# EAGLE design BUZZI-33 (EAGLE 4.15)
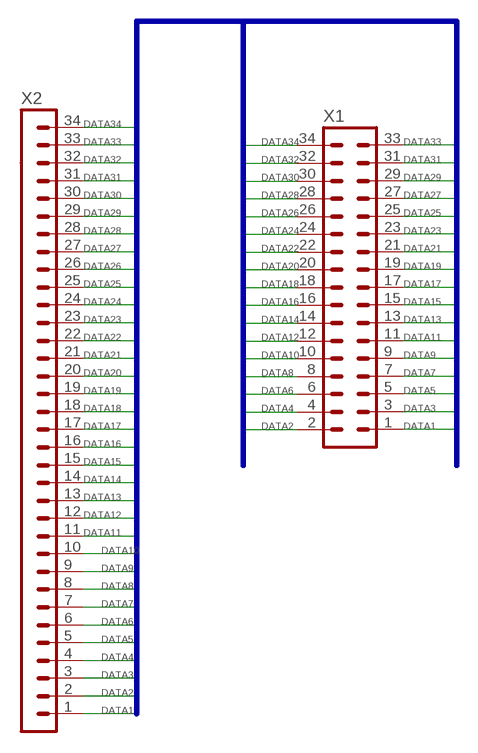
[diagram p0: schematic, sheet 1]

## Parts
X1  ML34  [ML34]
X2  MA34  [MA34-1]

## Nets
DATA1: X1.1 X2.1
DATA2: X1.2 X2.2
DATA3: X1.3 X2.3
DATA4: X1.4 X2.4
DATA5: X1.5 X2.5
DATA6: X1.6 X2.6
DATA7: X1.7 X2.7
DATA8: X1.8 X2.8
DATA9: X1.9 X2.9
DATA10: X1.10 X2.10
DATA11: X1.11 X2.11
DATA12: X1.12 X2.12
DATA13: X1.13 X2.13
DATA14: X1.14 X2.14
DATA15: X1.15 X2.15
DATA16: X1.16 X2.16
DATA17: X1.17 X2.17
DATA18: X1.18 X2.18
DATA19: X1.19 X2.19
DATA20: X1.20 X2.20
DATA21: X1.21 X2.21
DATA22: X1.22 X2.22
DATA23: X1.23 X2.23
DATA24: X1.24 X2.24
DATA25: X1.25 X2.25
DATA26: X1.26 X2.26
DATA27: X1.27 X2.27
DATA28: X1.28 X2.28
DATA29: X1.29 X2.29
DATA30: X1.30 X2.30
DATA31: X1.31 X2.31
DATA32: X1.32 X2.32
DATA33: X1.33 X2.33
DATA34: X1.34 X2.34

## Buses
DATA[1..34]

## Library data of the parts
X1 = con-harting-ml:ML34: HARTING
X2 = turbod3:MA34

## Net classes
0 default: width 0.5 mm

## Board
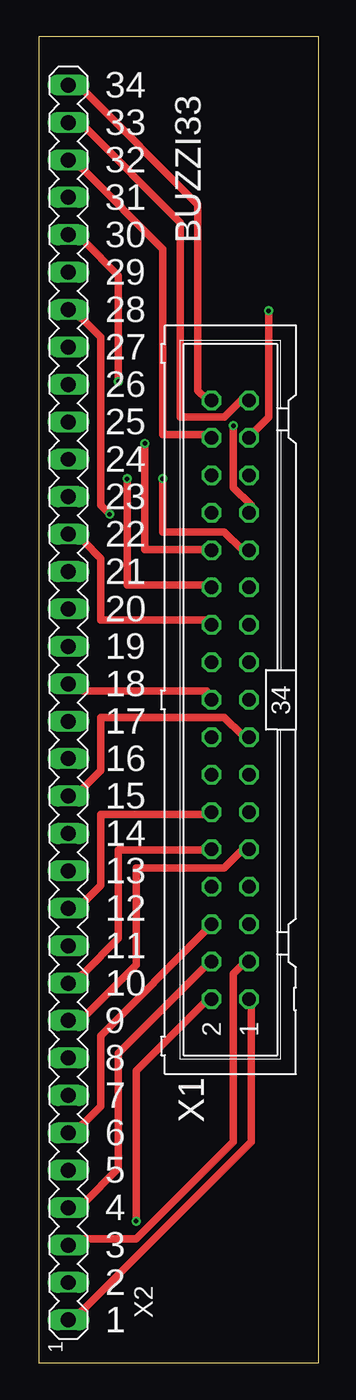
[diagram p1: board, top side]
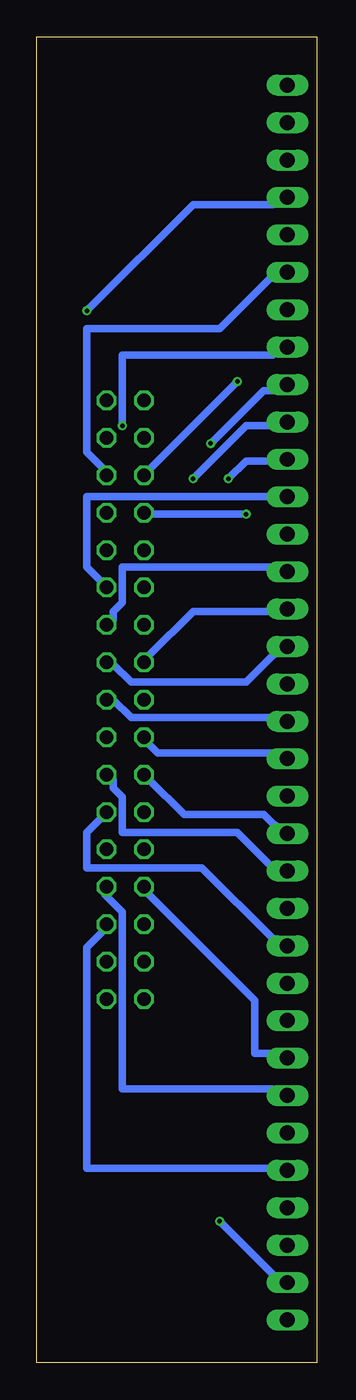
[diagram p2: board, bottom side, seen from below]

Size 19 x 90 mm. Coordinates in mm from the lower left corner, seen from the top.
Outline: 0,0 19,0 19,90 0,90 0,0
Copper layers (1*16): Top 0.035mm / dielectric 1.5mm / Bottom 0.035mm
Design rules "PCB-POOL": minimum track width 6mil, minimum drill 12mil, track to track 6mil, track to pad 6mil, pad to pad 6mil, via to via 6mil, smd to smd 6mil, copper to edge 20mil, drill to drill 8mil, minimum pad ring 8mil, minimum via ring 6mil, stop-mask expansion 3mil, vias tented up to drill 0mil, thermal gap 8mil

### Footprints (pad centres in the part's own frame; a part is rotated, then mirrored left to right if it is on the bottom)
ML34 = drill 0.914 octagon: 1 -20.32,-1.27; 2 -20.32,1.27; 3 -17.78,-1.27; 4 -17.78,1.27; 5 -15.24,-1.27; 6 -15.24,1.27; 7 -12.7,-1.27; 8 -12.7,1.27; 9 -10.16,-1.27; 10 -10.16,1.27; 11 -7.62,-1.27; 12 -7.62,1.27; 13 -5.08,-1.27; 14 -5.08,1.27; 15 -2.54,-1.27; 16 -2.54,1.27; 17 0,-1.27; 18 0,1.27; 19 2.54,-1.27; 20 2.54,1.27; 21 5.08,-1.27; 22 5.08,1.27; 23 7.62,-1.27; 24 7.62,1.27; 25 10.16,-1.27; 26 10.16,1.27; 27 12.7,-1.27; 28 12.7,1.27; 29 15.24,-1.27; 30 15.24,1.27; 31 17.78,-1.27; 32 17.78,1.27; 33 20.32,-1.27; 34 20.32,1.27
MA34-1 = drill 1.016 long: 1 -38.1,0; 2 -35.56,0; 3 -33.02,0; 4 -30.48,0; 5 -27.94,0; 6 -25.4,0; 7 -22.86,0; 8 -20.32,0; 9 -17.78,0; 10 -15.24,0; 11 -12.7,0; 12 -10.16,0; 13 -7.62,0; 14 -5.08,0; 15 -2.54,0; 16 0,0; 17 2.54,0; 18 5.08,0; 19 7.62,0; 20 10.16,0; 21 12.7,0; 22 15.24,0; 23 17.78,0; 24 20.32,0; 25 22.86,0; 26 25.4,0; 27 27.94,0; 28 30.48,0; 29 33.02,0; 30 35.56,0; 31 38.1,0; 32 40.64,0; 33 43.18,0; 34 45.72,0

### Placement (x,y rotation side)
X1  13,45 90 top
X2  2,41 90 top

### Tracks (layer width: path | path; a pad name or v marks a point on that pad's centre or on a via)
DATA1
  Top 0.5: X1.1 14.4,24.6 14.4,15 3,3.6 X2.1
DATA2  (via drill 0.3)
  Top 0.5: v6.6,9.6 6.6,19.8 11.4,24.6 X1.2
  Bottom 0.5: v6.6,9.6 3,6 X2.2
DATA3
  Top 0.5: X1.3 13.8,27 13.2,26.4 13.2,15 6.6,8.4 3,8.4 X2.3
DATA4
  Top 0.5: X1.4 11.4,27 5.4,21 5.4,13.2 3,10.8 X2.4
DATA5
  Bottom 0.5: X1.5 14.4,29.4 15.6,28.2 15.6,13.2 3,13.2 X2.5
DATA6
  Top 0.5: X1.6 11.4,29.4 4.2,22.2 4.2,17.4 3,16.2 X2.6
DATA7
  Bottom 0.5: X1.7 14.4,31.8 13.2,30.6 13.2,18.6 3,18.6 X2.7
DATA8
  Bottom 0.5: X1.8 11.4,31.8 4.2,24.6 4.2,21 3,21 X2.8
DATA9
  Top 0.5: X1.9 13.8,34.8 12.6,33.6 6.6,33.6 6.6,27 3,23.4 X2.9
DATA10
  Top 0.5: X1.10 11.4,34.8 5.4,34.8 5.4,28.8 3,26.4 X2.10
DATA11
  Bottom 0.5: X1.11 14.4,37.2 15.6,36 15.6,33.6 7.8,33.6 3,28.8 X2.11
DATA12
  Top 0.5: X1.12 11.4,37.2 4.2,37.2 4.2,32.4 3,31.2 X2.12
DATA13
  Bottom 0.5: X1.13 13.8,39.6 13.8,39 13.2,38.4 13.2,36 5.4,36 3,33.6 X2.13
DATA14
  Bottom 0.5: X1.14 11.4,39.6 9,37.2 3.6,37.2 3,36.6 X2.14
DATA15
  Top 0.5: X1.15 13.8,42.6 12.6,43.8 4.2,43.8 4.2,40.2 3,39 X2.15
DATA16
  Bottom 0.5: X1.16 11.4,42 10.8,41.4 3,41.4 X2.16
DATA17
  Bottom 0.5: X1.17 13.8,45 12.6,43.8 3,43.8 X2.17
DATA18
  Top 0.5: X1.18 11.4,45.6 3,45.6 X2.18
DATA19
  Bottom 0.5: X1.19 13.8,47.4 12.6,46.2 4.8,46.2 3,48 X2.19
DATA20
  Bottom 0.5: X1.20 11.4,48 8.4,51 3,51 X2.20
DATA21
  Bottom 0.5: X1.21 13.8,50.4 13.8,51 13.2,51.6 13.2,54 3,54 X2.21
DATA22
  Top 0.5: X1.22 11.4,50.4 4.2,50.4 4.2,54.6 3,55.8 X2.22
DATA23
  Bottom 0.5: X1.23 14.4,52.8 15.6,54 15.6,58.8 3,58.8 X2.23
DATA24  (via drill 0.3)
  Top 0.5: v6,60 6,52.8 11.4,52.8 X1.24
  Bottom 0.5: v6,60 4.8,61.2 3,61.2 X2.24
DATA25  (via drill 0.3)
  Top 0.5: v8.4,60 8.4,56.4 12.6,56.4 13.8,55.2 X1.25
  Bottom 0.5: v8.4,60 4.8,63.6 3,63.6 X2.25
DATA26  (via drill 0.3)
  Top 0.5: v7.2,62.4 7.2,55.2 11.4,55.2 X1.26
  Bottom 0.5: v7.2,62.4 3.6,66 3,66 X2.26
DATA27  (via drill 0.3)
  Top 0.5: v13.2,63.6 13.2,59.4 14.4,58.2 X1.27
  Bottom 0.5: v13.2,63.6 13.2,68.4 3,68.4 X2.27
DATA28  (via drill 0.3)
  Top 0.5: v4.8,57.6 4.2,58.2 4.2,69.6 3,70.8 X2.28
  Bottom 0.5: v4.8,57.6 11.4,57.6 X1.28
DATA29
  Bottom 0.5: X1.29 14.4,60.6 15.6,61.8 15.6,70.2 6.6,70.2 3,73.8 X2.29
DATA30  (via drill 0.3)
  Top 0.5: v5.4,66.6 5.4,73.8 3,76.2 X2.30
  Bottom 0.5: v5.4,66.6 11.4,60.6 X1.30
DATA31  (via drill 0.3)
  Top 0.5: v15.6,71.4 15.6,64.2 14.4,63 X1.31
  Bottom 0.5: v15.6,71.4 8.4,78.6 3,78.6 X2.31
DATA32
  Top 0.5: X1.32 11.4,63 8.4,63 8.4,75.6 3,81 X2.32
DATA33
  Top 0.5: X1.33 13.8,65.4 12.6,64.2 9.6,64.2 9.6,77.4 3,84 X2.33
DATA34
  Top 0.5: X1.34 11.4,65.4 10.8,66 10.8,78.6 3,86.4 X2.34

### Text on the board
tNames: 34 | 33 | 32 | 31 | 30 | BUZZI33 | 29 | 28 | 27 | 26 | 25 | 24 | 23 | 22 | 21 | 20 | 19 | 18 | 17 | 16 | 15 | 14 | 13 | 12 | 11 | 10 | 9 | 8 | 7 | 6 | 5 | 4 | 3 | 2 | 1